# Altium schematic sheet Dual_tone_generator.SchDoc
size A4; SheetNumber: 1; SheetTotal: 2
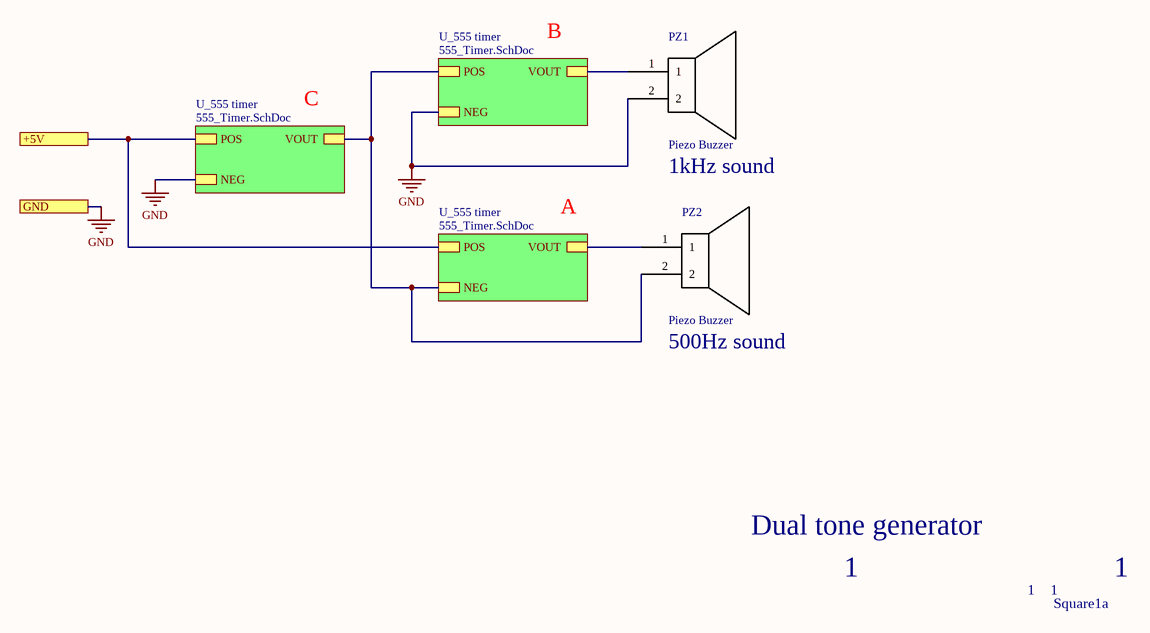
[diagram p0: Dual_tone_generator.SchDoc]

## Parts
PZ1  Piezo Buzzer  [Buzzer]
PZ2  Piezo Buzzer  [Buzzer]

## Sub-sheets
U_555 timer = 555_Timer.SchDoc: VOUT, NEG, POS
U_555 timer = 555_Timer.SchDoc: VOUT, POS, NEG
U_555 timer = 555_Timer.SchDoc: VOUT, POS, NEG

## Ports
+5V, GND

## Nets
GND: PZ1.2 ; port GND, sheet U_555 timer/NEG, sheet U_555 timer/NEG
+5V: port +5V, sheet U_555 timer/POS, sheet U_555 timer/POS
NetPZ1_1: PZ1.1 ; sheet U_555 timer/VOUT
NetPZ2_1: PZ2.1 ; sheet U_555 timer/VOUT
NetPZ2_2: PZ2.2 ; sheet U_555 timer/VOUT, sheet U_555 timer/POS, sheet U_555 timer/NEG

## Notes on the sheet
- B
- C
- 1kHz sound
- A
- 500Hz sound
- Dual tone generator
- 1
- Square1a

## Library data of the parts
PZ1 PZ2 = TP124005-2: High Temp Piezo Transducer; Resonant Frequency: 4000Hz; Rated Voltage: 5V; SPL @ 10cm: 75dBA; Manufacturer: DB Unlimited; Supplier 1: Digi-Key; Manufacturer Part Number: TP124005-2; RoHS: No; Category: Audio Products; Stock 1: 2115; Pricing 1: 1=0.78000, 10=0.64900, 25=0.60120, 50=0.56620, 100=0.53260 (USD); Supplier Part Number 1: 2104-TP124005-2CT-ND